# EasyEDA Pro project ProProject_SmartNixieClock_2023-12-15.epro, board Main
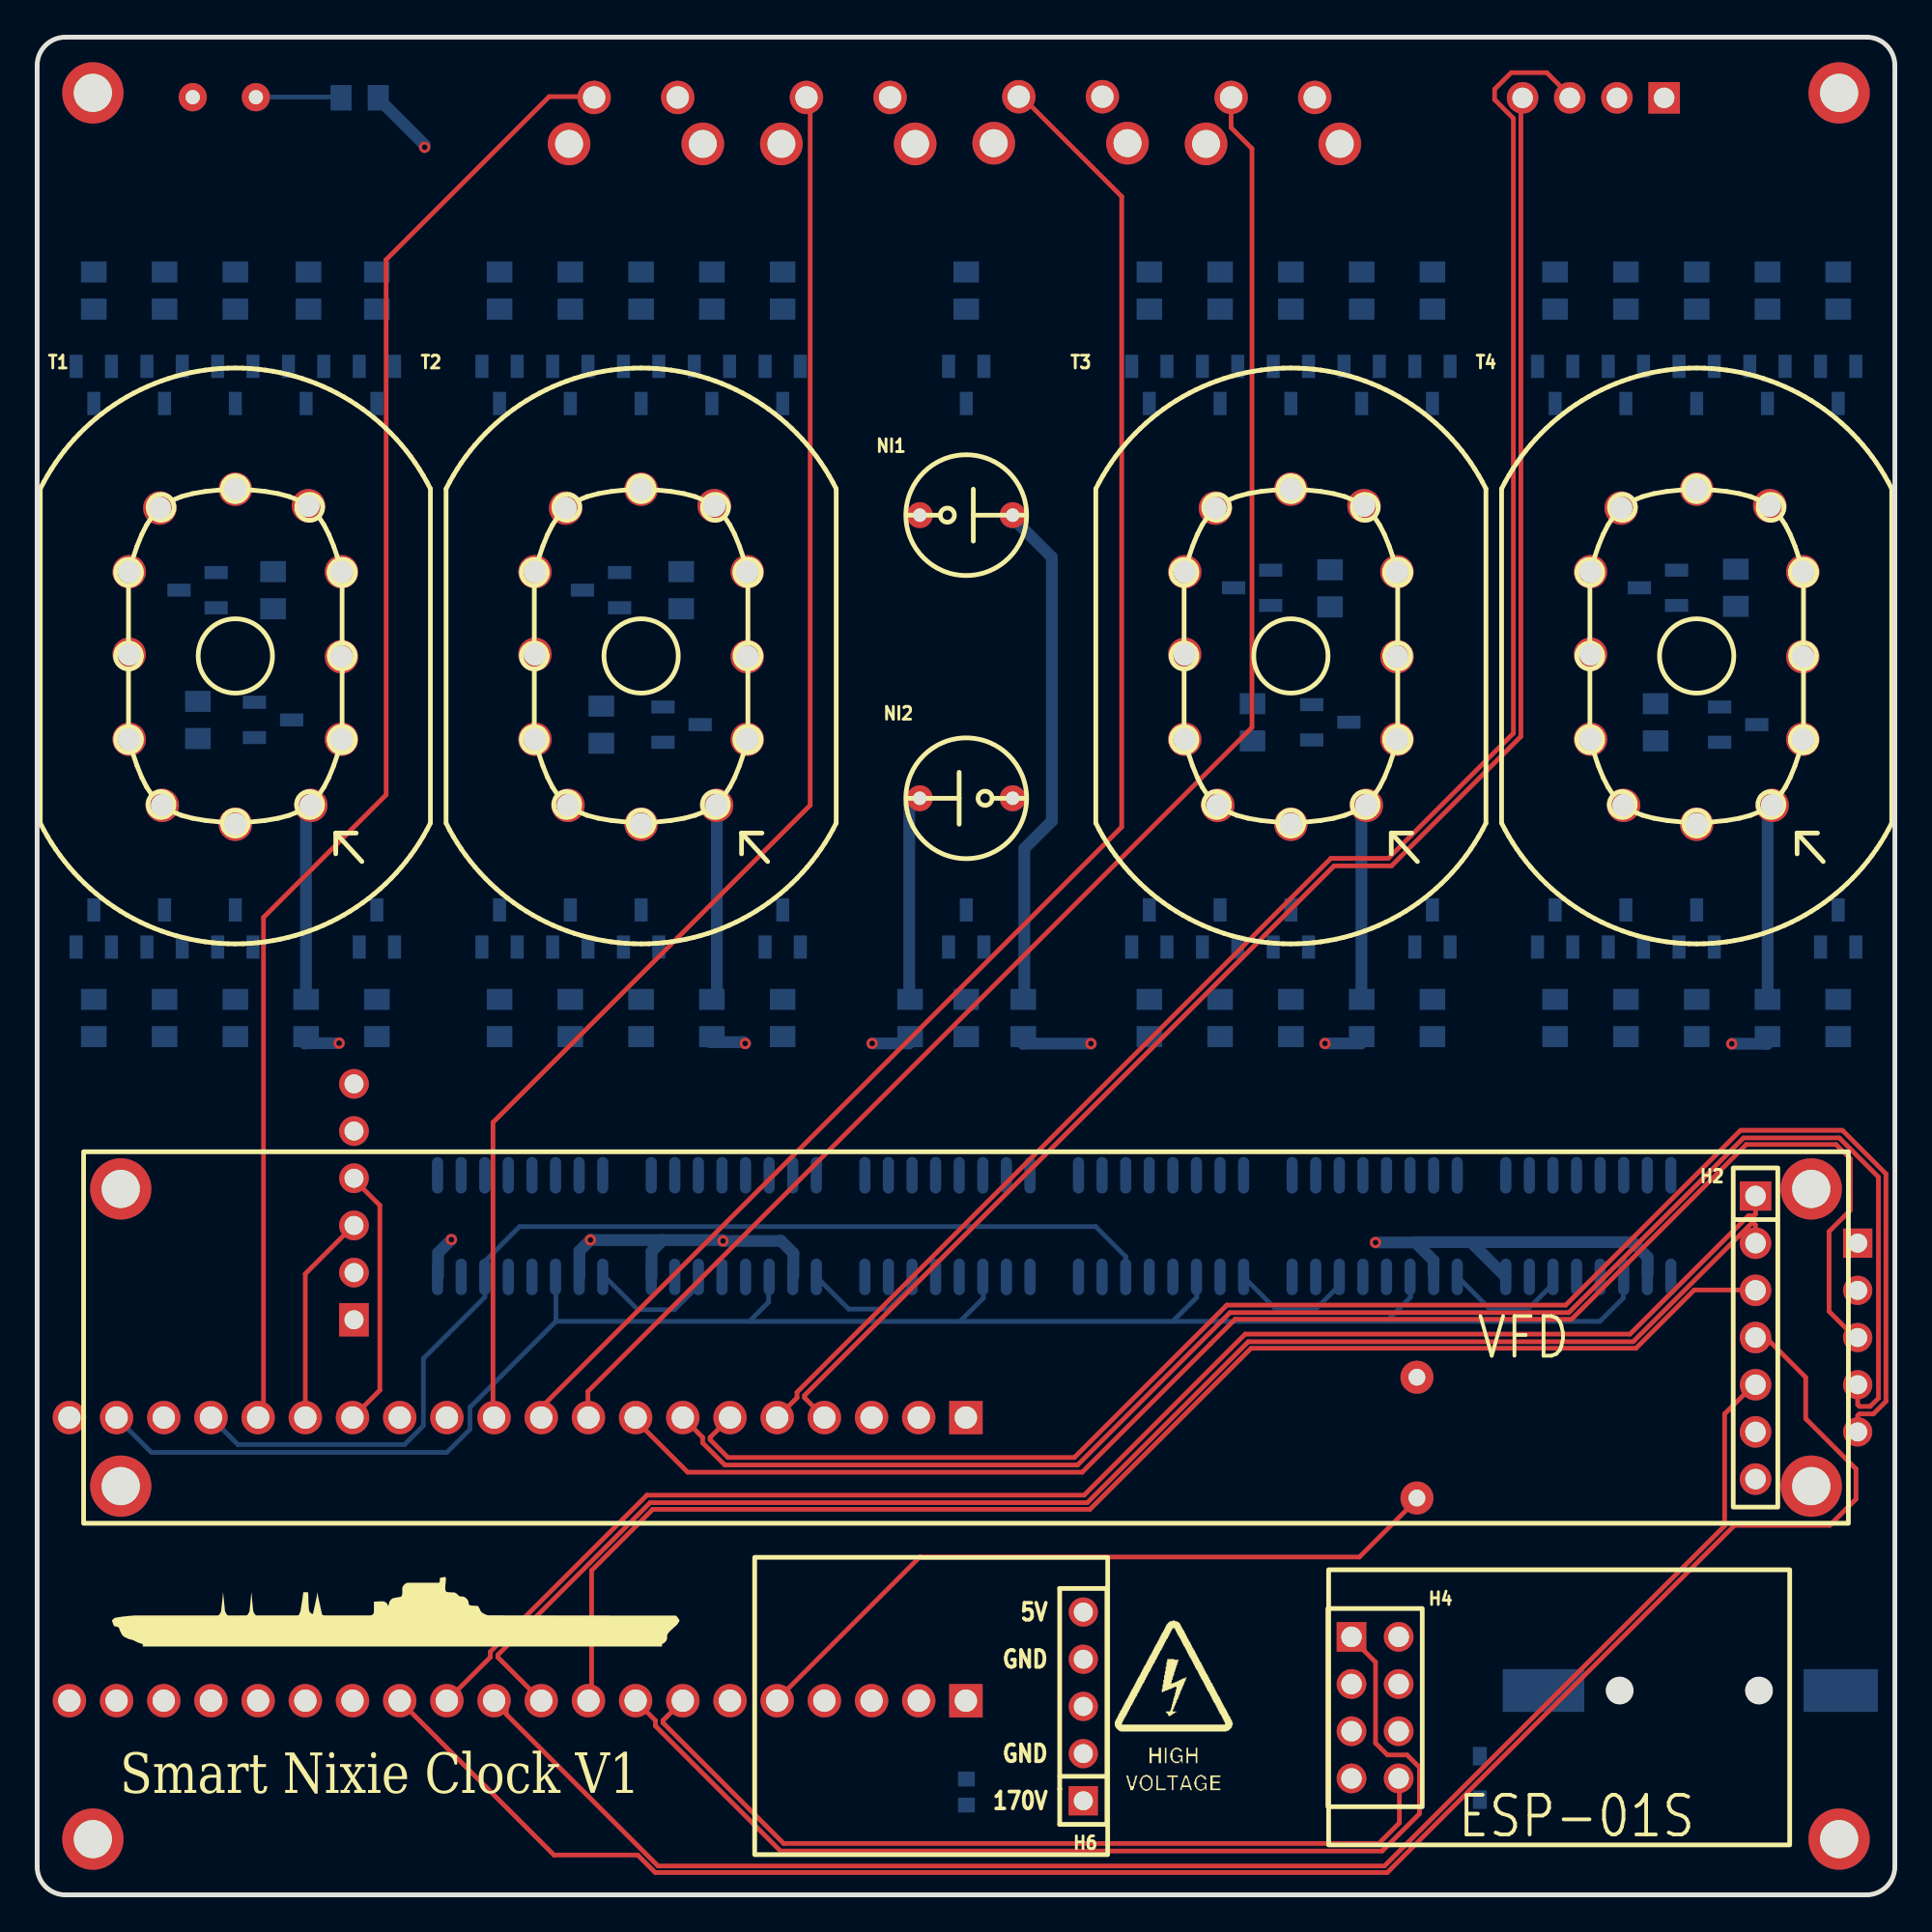
[diagram p4: board, top side]
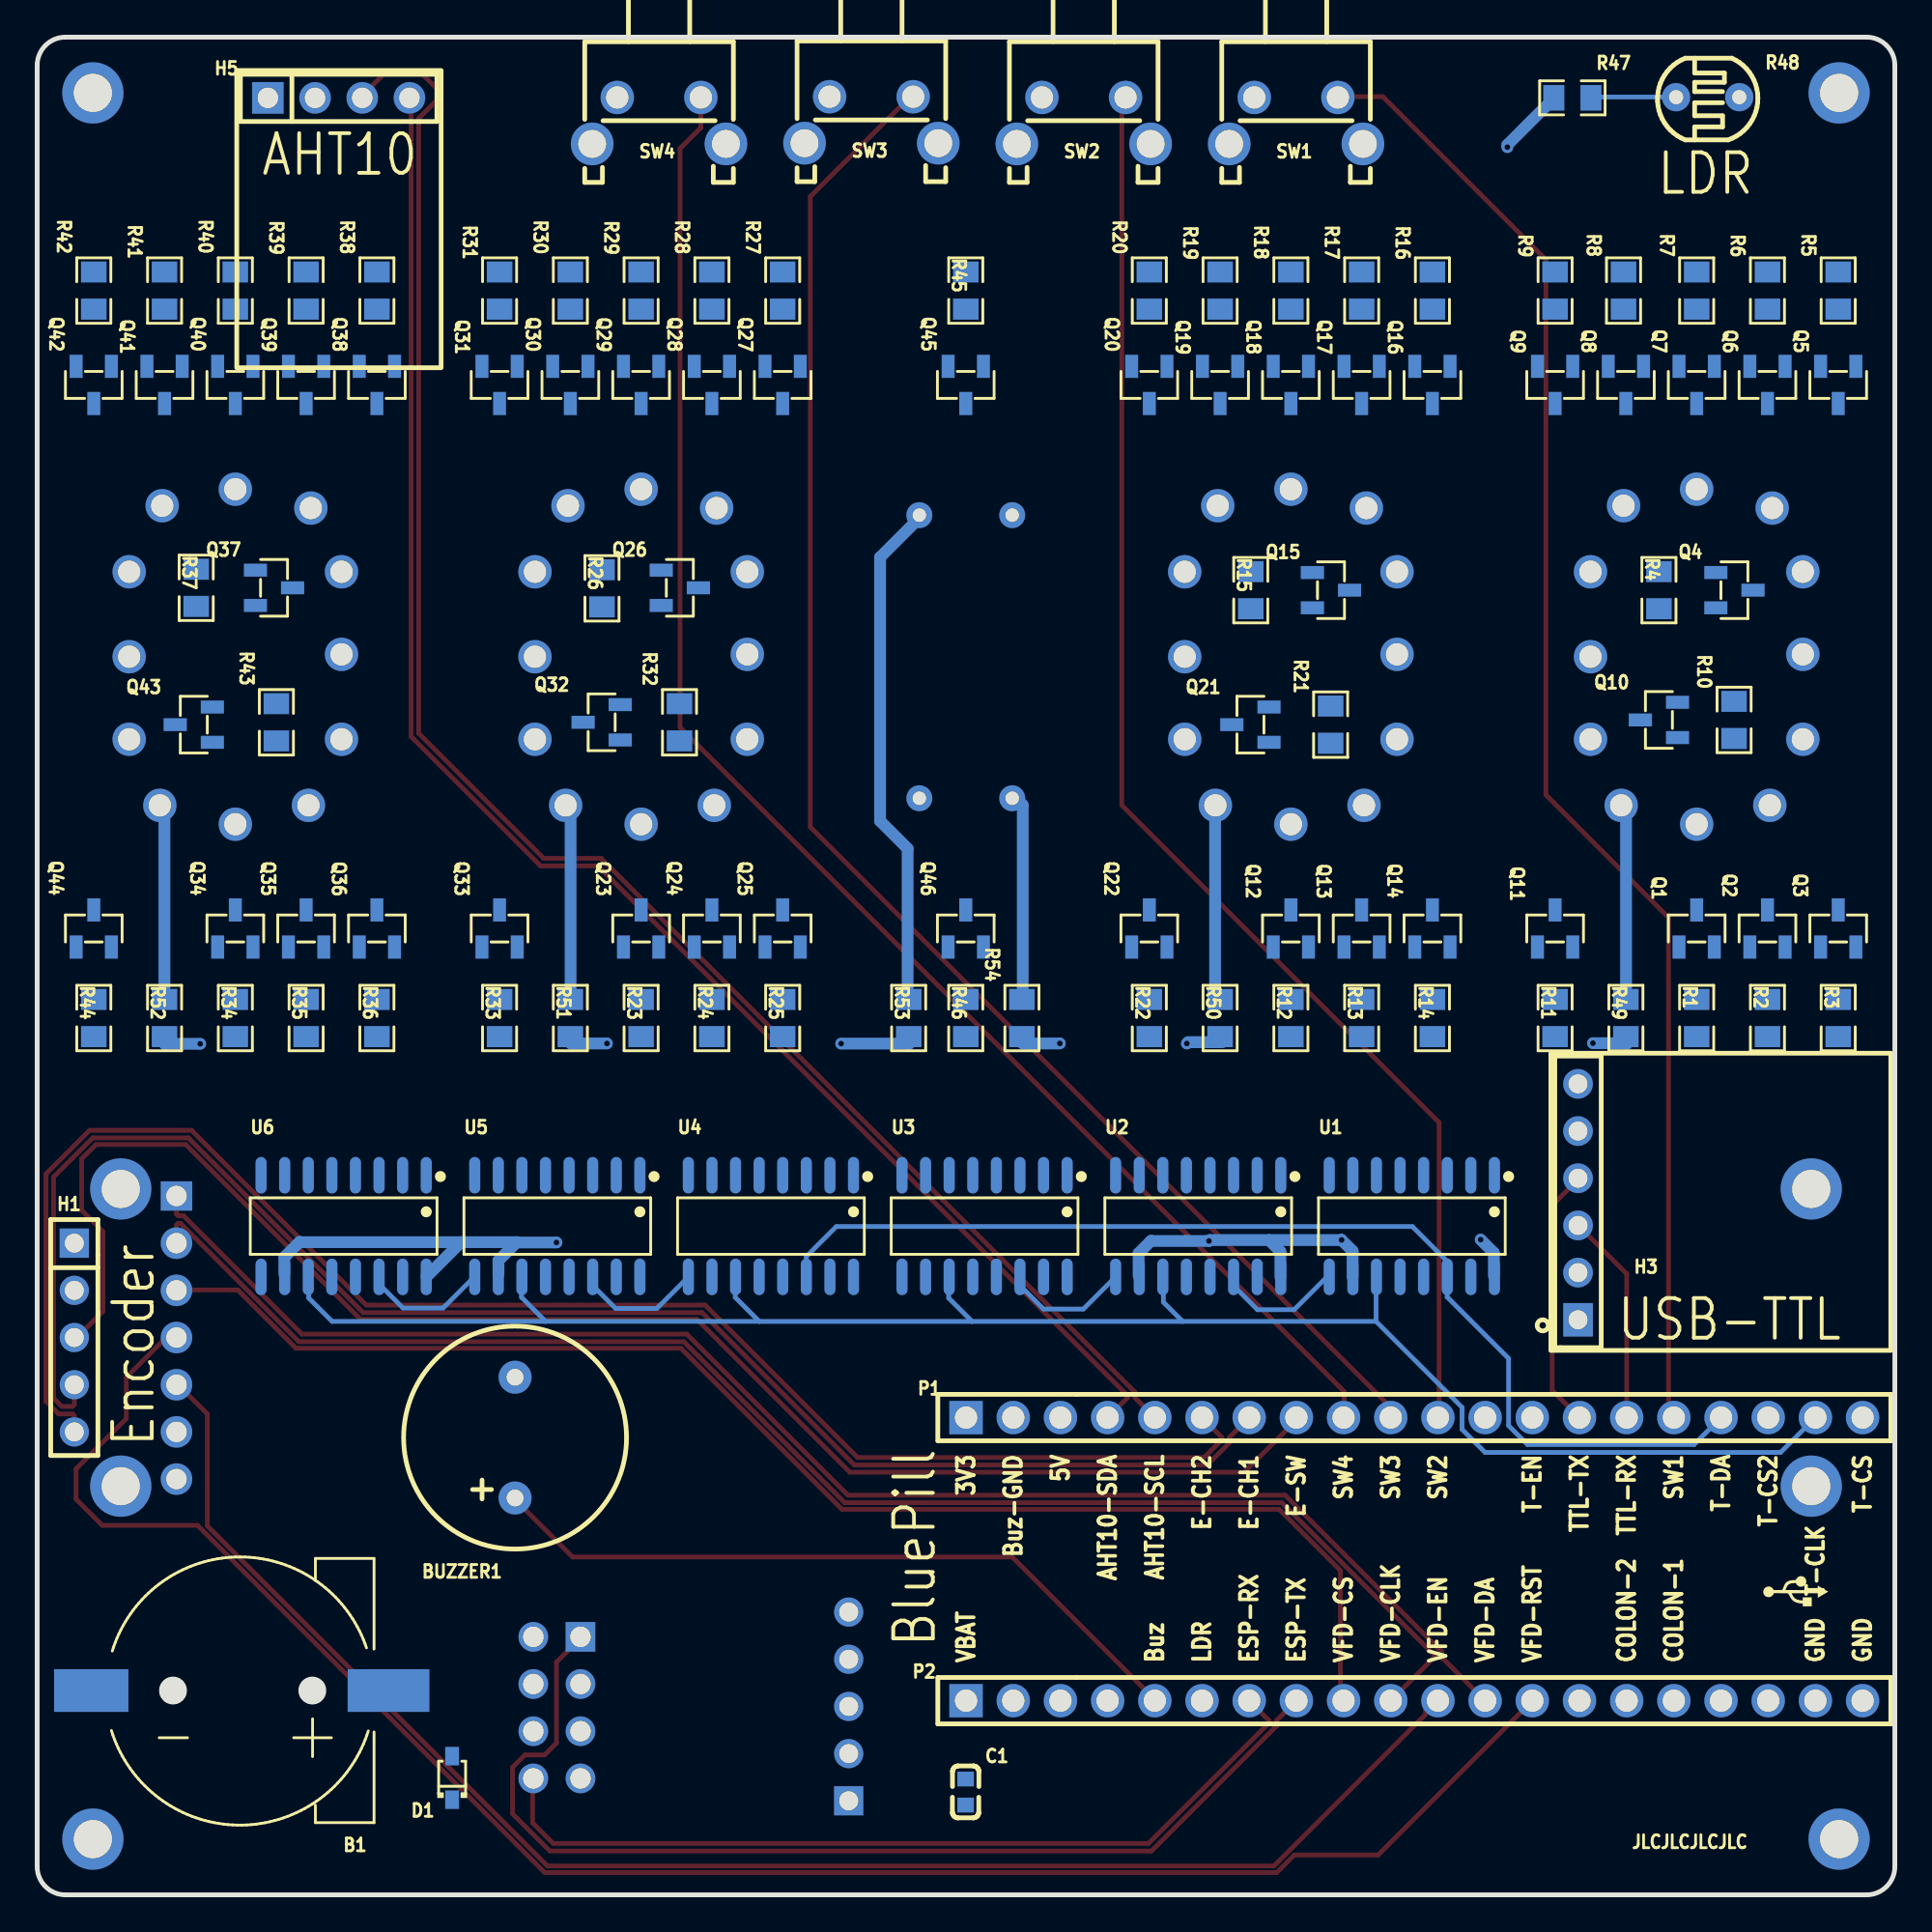
[diagram p5: board, bottom side, seen from below]

Outline 100 x 100 mm; copper layers: Top Layer, Inner1, Inner2, Bottom Layer. Coordinates in mm from the lower left corner of the outline.
Outline path: 0,98.48 0,1.52 arc(0.45,0.45) 1.52,0 98.48,0 arc(99.55,0.45) 100,1.52 100,98.48 arc(99.55,99.55) 98.48,100 1.52,100 arc(0.45,99.55) 0,98.48
Stack: Top Layer 0.035mm 外层铜厚1oz / Dielectric1 0.2104mm 7628 RC49% 8.6mil / Inner1 0.0152mm 内层铜厚 / Dielectric2 1.065mm 1.1mm H/HOZ 含铜 / Inner2 0.0152mm 内层铜厚 / Dielectric3 0.2104mm 7628 RC49% 8.6mil / Bottom Layer 0.035mm 外层铜厚1oz

## Design rules (mm)
net AHT10-SCL: DP1
net AHT10-SDA: DP1
net TTL-RX: DP3
net TTL-TX: DP3
net VFD-CLK: DP2
net ESP-TX: DP5
net ESP-RX: DP5
net VFD-DA: DP2
net T-DA: DP4
net T-CLK: DP4
net ENCODER-CH2: DP6
net ENCODER-CH1: DP6
template: 用户自定义配置
spacing copperThickness1oz (default): track to track 0.102, other pairs 0.152 to 0.3
spacing copperThickness2oz: track to track 0.203, other pairs 0.152 to 0.3
spacing copperThicknessInner0.5oz: track to track 0.089, other pairs 0.152 to 0.3
track width copperThickness1oz (default): min 0.102, default 0.254, max 2.54
track width copperThickness2oz: min 0.203, default 0.254, max 2.54
track width copperThickness0.5oz: min 0.089, default 0.254, max 2.54
track width +5V: min 0.635, default 0.635, max 2.54
track width +3V3: min 0.635, default 0.635, max 2.54
track width +170V: min 0.635, default 0.635, max 2.54
differential pair differentialPair (default): width min 0.127, default 0.254, max 2.54; gap min 0.152, default 0.152
via viaSize (default): diameter min 0.3, default 0.61, max 10; hole min 0.201, default 0.305, max 6.299
net +5V uses +5V
net $1N105872 uses +170V
net $1N105896 uses +170V
net $1N105920 uses +170V
net $1N105944 uses +170V
net $1N105947 uses +170V
net $1N105948 uses +170V
net +3V3 uses +3V3
net +170V uses +170V

## Placement (name value [footprint] x y rotation side)
B1  CR1220-2  [BAT-SMD_CR1220-2]  89.09 11 0 bottom
BUZZER1  2048Hz  [BUZ-TH_BD12.0-P6.50-D0.6-FD]  74.27 24.61 90 bottom
C1  100nF  [C0603]  50.02 5.53 270 bottom
D1  1N4148WS  [SOD-323_L1.8-W1.3-LS2.5-RD]  77.66 6.29 90 bottom
H1  PM254V-11-05-H85  [HDR-TH_5P-P2.54-V-F]  98 30 270 bottom
H2  PM254V-11-07-H85  [HDR-TH_7P-P2.54-V-F]  92.5 30 270 top
H3  PM254V-11-06-H85  [HDR-TH_6P-P2.54-V-F]  17.06 37.31 90 bottom
H4  PM254V-12-08-H85  [HDR-TH_8P-P2.54-V-F-R2-C4-S2.54]  72.02 10.08 270 top
H5  PM254V-11-04-H85  [HDR-TH_4P-P2.54-V-F]  83.77 96.73 180 bottom
H6  PM254V-11-05-H85  [HDR-TH_5P-P2.54-V-F]  56.31 10.14 90 top
NI1  -  [INS-1]  50.01 74.27 0 top
NI2  -  [INS-1]  50.01 59.03 180 top
NOREF  -  [Pad_e57]  3 97 0 top
NOREF#2  -  [Pad_e55]  97 97 0 top
NOREF#3  -  [Pad_e45]  4.5 22 0 top
NOREF#4  -  [Pad_e40]  4.5 38 0 top
NOREF#5  -  [Pad_e51]  95.5 38 0 top
NOREF#6  -  [Pad_e46]  95.5 22 0 top
NOREF#7  -  [Pad_e58]  3 3 0 top
NOREF#8  -  [Pad_e54]  97 3 0 top
P1  2.54-1*20P母  [HDR-TH_20P-P2.54-V-F]  25.87 25.69 180 bottom
P2  2.54-1*20P母  [HDR-TH_20P-P2.54-V-F]  25.87 10.45 180 bottom
Q1  13001  [SOT-23-3_L2.9-W1.3-P1.90-LS2.4-BR]  10.67 52.02 270 bottom
Q2  13001  [SOT-23-3_L2.9-W1.3-P1.90-LS2.4-BR]  6.86 52.02 270 bottom
Q3  13001  [SOT-23-3_L2.9-W1.3-P1.90-LS2.4-BR]  3.05 52.02 270 bottom
Q4  13001  [SOT-23-3_L2.9-W1.3-P1.90-LS2.4-BR]  8.64 70.23 0 bottom
Q5  13001  [SOT-23-3_L2.9-W1.3-P1.90-LS2.4-BR]  3.05 81.28 90 bottom
Q6  13001  [SOT-23-3_L2.9-W1.3-P1.90-LS2.4-BR]  6.86 81.28 90 bottom
Q7  13001  [SOT-23-3_L2.9-W1.3-P1.90-LS2.4-BR]  10.67 81.28 90 bottom
Q8  13001  [SOT-23-3_L2.9-W1.3-P1.90-LS2.4-BR]  14.48 81.28 90 bottom
Q9  13001  [SOT-23-3_L2.9-W1.3-P1.90-LS2.4-BR]  18.29 81.28 90 bottom
Q10  13001  [SOT-23-3_L2.9-W1.3-P1.90-LS2.4-BR]  12.7 63.25 180 bottom
Q11  13001  [SOT-23-3_L2.9-W1.3-P1.90-LS2.4-BR]  18.29 52.02 270 bottom
Q12  13001  [SOT-23-3_L2.9-W1.3-P1.90-LS2.4-BR]  32.51 52.02 270 bottom
Q13  13001  [SOT-23-3_L2.9-W1.3-P1.90-LS2.4-BR]  28.7 52.02 270 bottom
Q14  13001  [SOT-23-3_L2.9-W1.3-P1.90-LS2.4-BR]  24.89 52.02 270 bottom
Q15  13001  [SOT-23-3_L2.9-W1.3-P1.90-LS2.4-BR]  30.35 70.23 0 bottom
Q16  13001  [SOT-23-3_L2.9-W1.3-P1.90-LS2.4-BR]  24.89 81.28 90 bottom
Q17  13001  [SOT-23-3_L2.9-W1.3-P1.90-LS2.4-BR]  28.7 81.28 90 bottom
Q18  13001  [SOT-23-3_L2.9-W1.3-P1.90-LS2.4-BR]  32.51 81.28 90 bottom
Q19  13001  [SOT-23-3_L2.9-W1.3-P1.90-LS2.4-BR]  36.32 81.28 90 bottom
Q20  13001  [SOT-23-3_L2.9-W1.3-P1.90-LS2.4-BR]  40.13 81.28 90 bottom
Q21  13001  [SOT-23-3_L2.9-W1.3-P1.90-LS2.4-BR]  34.69 62.99 180 bottom
Q22  13001  [SOT-23-3_L2.9-W1.3-P1.90-LS2.4-BR]  40.13 52.02 270 bottom
Q23  13001  [SOT-23-3_L2.9-W1.3-P1.90-LS2.4-BR]  67.49 52.02 270 bottom
Q24  13001  [SOT-23-3_L2.9-W1.3-P1.90-LS2.4-BR]  63.68 52.02 270 bottom
Q25  13001  [SOT-23-3_L2.9-W1.3-P1.90-LS2.4-BR]  59.87 52.02 270 bottom
Q26  13001  [SOT-23-3_L2.9-W1.3-P1.90-LS2.4-BR]  65.41 70.36 0 bottom
Q27  13001  [SOT-23-3_L2.9-W1.3-P1.90-LS2.4-BR]  59.87 81.28 90 bottom
Q28  13001  [SOT-23-3_L2.9-W1.3-P1.90-LS2.4-BR]  63.68 81.28 90 bottom
Q29  13001  [SOT-23-3_L2.9-W1.3-P1.90-LS2.4-BR]  67.49 81.28 90 bottom
Q30  13001  [SOT-23-3_L2.9-W1.3-P1.90-LS2.4-BR]  71.3 81.28 90 bottom
Q31  13001  [SOT-23-3_L2.9-W1.3-P1.90-LS2.4-BR]  75.11 81.28 90 bottom
Q32  13001  [SOT-23-3_L2.9-W1.3-P1.90-LS2.4-BR]  69.61 63.12 180 bottom
Q33  13001  [SOT-23-3_L2.9-W1.3-P1.90-LS2.4-BR]  75.11 52.02 270 bottom
Q34  13001  [SOT-23-3_L2.9-W1.3-P1.90-LS2.4-BR]  89.33 52.02 270 bottom
Q35  13001  [SOT-23-3_L2.9-W1.3-P1.90-LS2.4-BR]  85.52 52.02 270 bottom
Q36  13001  [SOT-23-3_L2.9-W1.3-P1.90-LS2.4-BR]  81.71 52.02 270 bottom
Q37  13001  [SOT-23-3_L2.9-W1.3-P1.90-LS2.4-BR]  87.25 70.36 0 bottom
Q38  13001  [SOT-23-3_L2.9-W1.3-P1.90-LS2.4-BR]  81.71 81.28 90 bottom
Q39  13001  [SOT-23-3_L2.9-W1.3-P1.90-LS2.4-BR]  85.52 81.28 90 bottom
Q40  13001  [SOT-23-3_L2.9-W1.3-P1.90-LS2.4-BR]  89.33 81.28 90 bottom
Q41  13001  [SOT-23-3_L2.9-W1.3-P1.90-LS2.4-BR]  93.14 81.28 90 bottom
Q42  13001  [SOT-23-3_L2.9-W1.3-P1.90-LS2.4-BR]  96.95 81.28 90 bottom
Q43  13001  [SOT-23-3_L2.9-W1.3-P1.90-LS2.4-BR]  91.57 62.99 180 bottom
Q44  13001  [SOT-23-3_L2.9-W1.3-P1.90-LS2.4-BR]  96.95 52.02 270 bottom
Q45  13001  [SOT-23-3_L2.9-W1.3-P1.90-LS2.4-BR]  50.01 81.28 90 bottom
Q46  13001  [SOT-23-3_L2.9-W1.3-P1.90-LS2.4-BR]  50.01 52.02 270 bottom
R1  1kΩ  [R0805]  10.67 47.2 90 bottom
R2  1kΩ  [R0805]  6.86 47.2 90 bottom
R3  1kΩ  [R0805]  3.05 47.2 90 bottom
R4  1kΩ  [R0805]  12.7 70.23 90 bottom
R5  1kΩ  [R0805]  3.05 86.36 270 bottom
R6  1kΩ  [R0805]  6.86 86.36 270 bottom
R7  1kΩ  [R0805]  10.67 86.36 270 bottom
R8  1kΩ  [R0805]  14.61 86.36 270 bottom
R9  1kΩ  [R0805]  18.29 86.36 270 bottom
R10  1kΩ  [R0805]  8.65 63.25 270 bottom
R11  1kΩ  [R0805]  18.29 47.2 90 bottom
R12  1kΩ  [R0805]  32.51 47.2 90 bottom
R13  1kΩ  [R0805]  28.7 47.2 90 bottom
R14  1kΩ  [R0805]  24.89 47.2 90 bottom
R15  1kΩ  [R0805]  34.67 70.23 90 bottom
R16  1kΩ  [R0805]  24.89 86.36 270 bottom
R17  1kΩ  [R0805]  28.7 86.36 270 bottom
R18  1kΩ  [R0805]  32.51 86.36 270 bottom
R19  1kΩ  [R0805]  36.32 86.36 270 bottom
R20  1kΩ  [R0805]  40.13 86.36 270 bottom
R21  1kΩ  [R0805]  30.37 62.99 270 bottom
R22  1kΩ  [R0805]  40.13 47.2 90 bottom
R23  1kΩ  [R0805]  67.49 47.2 90 bottom
R24  1kΩ  [R0805]  63.68 47.2 90 bottom
R25  1kΩ  [R0805]  59.87 47.2 90 bottom
R26  1kΩ  [R0805]  69.6 70.33 90 bottom
R27  1kΩ  [R0805]  59.87 86.36 270 bottom
R28  1kΩ  [R0805]  63.68 86.36 270 bottom
R29  1kΩ  [R0805]  67.49 86.36 270 bottom
R30  1kΩ  [R0805]  71.3 86.36 270 bottom
R31  1kΩ  [R0805]  75.11 86.36 270 bottom
R32  1kΩ  [R0805]  65.42 63.12 270 bottom
R33  1kΩ  [R0805]  75.11 47.2 90 bottom
R34  1kΩ  [R0805]  89.33 47.2 90 bottom
R35  1kΩ  [R0805]  85.52 47.2 90 bottom
R36  1kΩ  [R0805]  81.71 47.2 90 bottom
R37  1kΩ  [R0805]  91.44 70.36 90 bottom
R38  1kΩ  [R0805]  81.71 86.36 270 bottom
R39  1kΩ  [R0805]  85.52 86.36 270 bottom
R40  1kΩ  [R0805]  89.33 86.36 270 bottom
R41  1kΩ  [R0805]  93.14 86.36 270 bottom
R42  1kΩ  [R0805]  96.95 86.36 270 bottom
R43  1kΩ  [R0805]  87.12 63.12 270 bottom
R44  1kΩ  [R0805]  96.95 47.2 90 bottom
R45  1kΩ  [R0805]  50.01 86.36 90 bottom
R46  1kΩ  [R0805]  50.01 47.2 90 bottom
R47  10kΩ  [R0805]  17.36 96.73 0 bottom
R48  GL5516  [RES-TH_L5.1-W4.3-P3.40-D0.5]  10.08 96.77 90 bottom
R49  20kΩ  [R0805]  14.48 47.2 90 bottom
R50  20kΩ  [R0805]  36.32 47.2 90 bottom
R51  20kΩ  [R0805]  71.3 47.2 90 bottom
R52  20kΩ  [R0805]  93.14 47.2 90 bottom
R53  200kΩ  [R0805]  53.09 47.2 90 bottom
R54  200kΩ  [R0805]  46.99 47.2 270 bottom
SW1  TS-1093C-A13B2-D1  [SW-TH_TS-1093C-A13B3-D1]  32.23 95.5 0 bottom
SW2  TS-1093C-A13B2-D1  [SW-TH_TS-1093C-A13B3-D1]  43.66 95.5 0 bottom
SW3  TS-1093C-A13B2-D1  [SW-TH_TS-1093C-A13B3-D1]  55.09 95.54 0 bottom
SW4  TS-1093C-A13B2-D1  [SW-TH_TS-1093C-A13B3-D1]  66.52 95.5 0 bottom
T1  IN-12b辉光管  [IN-12b(正常,插針在上面)]  10.67 66.65 0 top
T2  IN-12b辉光管  [IN-12b(正常,插針在上面)]  32.51 66.65 0 top
T3  IN-12b辉光管  [IN-12b(正常,插針在上面)]  67.49 66.65 0 top
T4  IN-12b辉光管  [IN-12b(正常,插針在上面)]  89.33 66.65 0 top
U1  74HC595D,118  [SOIC-16_L9.9-W3.9-P1.27-LS6.0-BL]  26 36 0 bottom
U2  74HC595D,118  [SOIC-16_L9.9-W3.9-P1.27-LS6.0-BL]  37.5 36 0 bottom
U3  74HC595D,118  [SOIC-16_L9.9-W3.9-P1.27-LS6.0-BL]  49 36 0 bottom
U4  74HC595D,118  [SOIC-16_L9.9-W3.9-P1.27-LS6.0-BL]  60.5 36 0 bottom
U5  74HC595D,118  [SOIC-16_L9.9-W3.9-P1.27-LS6.0-BL]  72 36 0 bottom
U6  74HC595D,118  [SOIC-16_L9.9-W3.9-P1.27-LS6.0-BL]  83.5 36 0 bottom

## Footprints (pads in the part's own frame, mm; a bottom-side part is the same pattern mirrored in y, then rotated)
BAT-SMD_CR1220-2
  rect 4.4x2.3 smd: 1(-8,0)
  rect 4x2.3 smd: 2(8,0)
BUZ-TH_BD12.0-P6.50-D0.6-FD
  round 1.778 hole 0.9: 1(-3.251,0) 2(3.251,0)
C0603
  rect 0.8x0.9 smd: 1(-0.7,0) 2(0.7,0)
HDR-TH_4P-P2.54-V-F
  rect 1.7x1.7 hole 1.1: 1(-3.81,0)
  round 1.7 hole 1.1: 2(-1.27,0) 3(1.27,0) 4(3.81,0)
HDR-TH_5P-P2.54-V-F
  rect 1.575x1.575 hole 1.02: 1(-5.08,0)
  round 1.575 hole 1.02: 2(-2.54,0) 3(0,0) 4(2.54,0) 5(5.08,0)
HDR-TH_6P-P2.54-V-F
  rect 1.8x1.6 hole 1.02: 1(-6.35,0)
  round 1.6 hole 1.02: 2(-3.81,0) 3(-1.27,0) 4(1.27,0) 5(3.81,0) 6(6.35,0)
HDR-TH_7P-P2.54-V-F
  rect 1.575x1.7 hole 1.1: 1(-7.62,0)
  round 1.7 hole 1.1: 2(-5.08,0) 3(-2.54,0) 4(0,0) 5(2.54,0) 6(5.08,0) 7(7.62,0)
HDR-TH_8P-P2.54-V-F-R2-C4-S2.54
  rect 1.6x1.6 hole 1.1: 1(-3.81,-1.27)
  round 1.6 hole 1.1: 2(-3.81,1.27) 3(-1.27,-1.27) 4(-1.27,1.27) 5(1.27,-1.27) 6(1.27,1.27) 7(3.81,-1.27) 8(3.81,1.27)
HDR-TH_20P-P2.54-V-F
  rect 1.8x1.8 hole 1.2: 1(-24.13,0)
  round 1.8 hole 1.2: 2(-21.59,0) 3(-19.05,0) 4(-16.51,0) 5(-13.97,0) 6(-11.43,0) 7(-8.89,0) 8(-6.35,0) 9(-3.81,0) 10(-1.27,0) 11(1.27,0) 12(3.81,0) 13(6.35,0) 14(8.89,0) 15(11.43,0) 16(13.97,0) 17(16.51,0) 18(19.05,0) 19(21.59,0) 20(24.13,0)
IN-12b(正常,插針在上面)
  round 1.8 hole 1.2x1.05: 1(4.064,-8.001) 2(5.715,-4.445) 3(5.715,0) 4(5.715,4.572) 5(3.937,8.128) 6(0,9.017) 7(-4.064,8.001) 8(-5.715,4.572) 9(-5.715,0.127) 10(-5.715,-4.445) 11(-3.937,-8.001) 12(0,-9.017)
INS-1
  round 1.4 hole 0.72: 1(2.5,0) 2(-2.5,0)
Pad_e40
  round 3.3 hole 2.05: M2(0,0)
Pad_e45
  round 3.3 hole 2.05: M2(0,0)
Pad_e46
  round 3.3 hole 2.05: M2(0,0)
Pad_e51
  round 3.3 hole 2.05: M2(0,0)
Pad_e54
  round 3.3 hole 2.05: M2(0,0)
Pad_e55
  round 3.3 hole 2.05: M2(0,0)
Pad_e57
  round 3.3 hole 2.05: M2(0,0)
Pad_e58
  round 3.3 hole 2.05: M2(0,0)
R0805
  rect 1.133x1.377 smd: 1(-1,0) 2(1,0)
RES-TH_L5.1-W4.3-P3.40-D0.5
  round 1.524 hole 0.762: 1(0,1.7) 2(0,-1.7)
SOD-323_L1.8-W1.3-LS2.5-RD
  rect 1x0.75 smd: 1(-1.173,0) 2(1.173,0)
SOIC-16_L9.9-W3.9-P1.27-LS6.0-BL
  oval 0.602x1.971 smd: 1(-4.445,-2.736) 2(-3.175,-2.736) 3(-1.905,-2.736) 4(-0.635,-2.736) 5(0.635,-2.736) 6(1.905,-2.736) 7(3.175,-2.736) 8(4.445,-2.736) 9(4.445,2.736) 10(3.175,2.736) 11(1.905,2.736) 12(0.635,2.736) 13(-0.635,2.736) 14(-1.905,2.736) 15(-3.175,2.736) 16(-4.445,2.736)
SOT-23-3_L2.9-W1.3-P1.90-LS2.4-BR
  rect 1.25x0.7 smd: 1(1,-0.95) 2(1,0.95) 3(-1,0)
SW-TH_TS-1093C-A13B3-D1
  round 1.8 hole 1.2: 1(-2.25,-1.25) 2(2.25,-1.25)
  round 2.3 hole 1.5: 3(-3.6,1.25) 4(3.6,1.25)

## Nets
As in the schematic.

Pads without a net: H3 1 2; H4 3 4 5 6; H6 3; NOREF M2; NOREF#2 M2; NOREF#3 M2; NOREF#4 M2; NOREF#5 M2; NOREF#6 M2; NOREF#7 M2; NOREF#8 M2; P1 12; P2 2 3 4 14 17 18; SW1 3 4; SW2 3 4; SW3 3 4; SW4 3 4; U3 6 7 9; U6 6 7 9

## Via types
v1: diameter 0.61, hole 0.305, Top Layer to Bottom Layer, 11 vias

## Routing (per net, layer and track width the routed paths; a pad name or vN(x,y) marks a point on that pad's centre or on a via; arc(x,y) is an arc through that point)
+3V3: length 126.7
  Inner2 w0.635: 70.72,6.36 70.72,5.76 68.34,3.38 53.32,3.38 52.69,4.01 52.69,22.89 49.89,25.69 ; 50.15,25.81 23.11,52.85 23.11,91.87 20.94,94.04
  Bottom Layer w0.635: 18.38,96.68 20.86,94.2 v1(20.86,94.08)
+5V: length 284
  Inner1 w0.635: 92.67,24.85 95.41,27.58 95.41,30.74 97.21,32.54 98.02,32.54 ; 48.39,22.1 55.27,15.23 56.41,15.23 ; 48.39,22.1 65.1,22.1 67.49,24.49 83.66,24.49 ; 48.39,22.1 44.96,25.54 ; 72.05,35.11 54.21,35.11 45.13,26.03 ; 83.66,24.49 91.98,24.49 92.49,25 ; 83.66,24.49 89.75,30.57 89.75,39.69 94.86,44.8 94.86,56.91 96.97,59.02 96.97,87.34 87.6,96.71 ; 83.66,24.49 83.65,24.47 ; 45.13,26.03 45.04,25.94 ; 45.13,26.03 45.13,34.82 38.72,41.23 17.04,41.23 ; 87.64,96.8 87.25,96.41 ; 36.95,35.19 41.01,31.13 41.01,29.39 44.73,25.67 ; v1(29.78,35.25) 22.33,35.25
  Bottom Layer w0.635: 74.18,35.13 77.19,35.13 ; 74.18,35.13 74.16,35.12 v1(72.05,35.12) ; 74.18,35.13 75.17,34.14 75.17,33.41 ; 77.19,35.13 85.85,35.13 85.87,35.15 86.69,34.32 86.69,33.42 ; 77.19,35.13 79.04,33.28 ; 40.71,33.32 40.71,34.54 40.04,35.21 40.03,35.2 v1(36.92,35.2) 36.87,35.25 33.69,35.25 ; 33.08,33.25 33.08,34.63 33.69,35.25 ; v1(22.3,35.27) 21.58,34.56 21.58,33.33 ; 29.19,33.26 29.19,34.66 29.79,35.26 29.81,35.25 33.69,35.25
+170V: length 131.6
  Inner1 w0.635: 16.28,45.85 16.31,45.82 v1(56.72,45.82) 91.23,45.82 91.23,45.82
  Inner2 w0.635: 56.74,45.82 56.73,45.81 56.73,45.78 56.75,45.78 59.87,42.66 59.87,8.63 56.52,5.28
  Bottom Layer w0.635: 14.41,45.82 14.44,45.85 v1(16.25,45.85) ; v1(38.11,45.83) 38.04,45.9 36.19,45.9 ; v1(44.95,45.83) 46.94,45.83 46.98,45.88 ; v1(56.72,45.82) 53.09,45.82 53.07,45.8 ; v1(91.22,45.81) 93.12,45.81 93.13,45.8 ; 71.3,45.86 71.26,45.83 v1(69.33,45.83)
AHT10-SCL: length 95.2
  Top Layer w0.254: 82.49,96.71 82.49,96.86 81.26,98.09 79.35,98.09 78.46,97.2 78.46,96.64 79.46,95.63 79.46,62.53 72.73,55.79 69.64,55.79 40.9,27.05 40.9,26.76 P1.5
AHT10-SDA: length 89.2
  Top Layer w0.254: P1.4 41.31,26.76 41.31,26.89 69.81,55.39 72.9,55.39 79.87,62.36 79.87,96.64 79.85,96.66
BUZZER: length 38.8
  Top Layer w0.254: 74.33,21.34 71.18,18.19 47.51,18.19 39.94,10.61
BUZZER-GND: length 27.2
  Inner1 w0.254: 74.21,27.82 49.93,27.82 47.88,25.78
ENCODER-CH1: length 88.1
  Top Layer w0.254: H1.4 98,26.38 98.09,26.29 98.67,26.29 99.12,26.74 99.12,38.64 97.01,40.75 91.86,40.75 82.45,31.34 64.21,31.34 56.01,23.14 37.01,23.14 35.82,24.33 35.82,24.62 P1.7
ENCODER-CH2: length 88.5
  Top Layer w0.254: P1.6 36.23,24.62 36.23,24.5 37.18,23.55 55.84,23.55 64.04,31.75 82.28,31.75 91.69,41.15 97.18,41.15 99.52,38.81 99.52,26.57 98.84,25.89 98.09,25.89 98,25.8 H1.5
ENCODER-SW: length 85
  Top Layer w0.254: 32.17,25.6 35.02,22.75 56.26,22.75 63.16,29.66 63.16,29.66 64.48,30.98 82.6,30.98 92,40.39 96.83,40.39 97.6,39.62 97.6,36.85 96.46,35.71 96.46,31.41 97.84,30.03 97.97,30.03
ESP-RX: length 46.8
  Top Layer w0.254: P2.7 33.69,9.38 33.69,9.26 40.18,2.77 72.22,2.77 73.33,3.87 73.33,6.18 73.29,6.22
ESP-TX: length 58.1
  Top Layer w0.254: 70.78,13.82 70.78,13.8 72.05,12.53 72.05,8.17 72.69,7.53 73.74,7.53 74.41,6.86 74.41,4.37 72.4,2.36 40.01,2.36 33.28,9.09 33.28,9.38 P2.8
LDR: length 102.5
  Inner2 w0.254: 37.17,10.62 24.61,23.18 22.3,23.18 20.82,24.65 20.82,71.51 11.87,80.46 11.87,96.57 11.78,96.66
  Bottom Layer w0.254: 16.38,96.78 12.01,96.78 11.89,96.9
SW1: length 79.7
  Top Layer w0.254: 29.96,96.8 27.56,96.8 18.78,88.01 18.79,88 18.79,59.22 12.18,52.61 12.18,25.91
SW2: length 78.5
  Top Layer w0.254: 41.61,96.82 41.61,58.66 24.54,41.58 24.54,25.38
SW3: length 86.2
  Top Layer w0.254: 27.18,25.72 27.18,26.28 58.38,57.48 58.38,91.42 53.02,96.78
SW4: length 86.4
  Top Layer w0.254: 29.65,25.5 29.65,27.1 65.39,62.84 65.39,94 64.27,95.13 64.27,96.62
T-CLK: length 101.3
  Bottom Layer w0.254: 49.68,30.87 50.93,32.12 50.93,33.23 ; 49.68,30.87 61.13,30.87 ; 49.68,30.87 38.34,30.87 ; 39.38,33.25 39.38,31.91 38.34,30.87 ; 27.93,30.87 38.34,30.87 ; 27.93,30.87 23.3,26.24 23.3,25.06 22.06,23.82 6.15,23.82 P1.19 ; 27.93,30.87 27.93,33.33 27.85,33.41 ; 73.93,33.28 73.93,32.17 72.63,30.87 ; 61.13,30.87 62.42,32.16 62.42,33.26 ; 61.13,30.87 72.63,30.87 ; 72.63,30.87 84.12,30.87 85.38,32.13 85.38,33.26
T-DA: length 59.7
  Bottom Layer w0.254: P1.17 10.81,24.24 19.77,24.24 20.79,25.26 20.79,28.88 24.1,32.18 24.1,34.1 25.97,35.97 56.98,35.97 58.6,34.36 58.6,33.25
TTL-RX: length 11.3
  Top Layer w0.254: 16.98,35.98 14.44,33.44 P1.15
TTL-TX: length 14.1
  Top Layer w0.254: 17.04,38.57 17.04,38.52 18.45,37.12 18.45,27.16 P1.14
VFD-CLK: length 81.8
  Top Layer w0.254: H2.2 92.5,36.06 92.41,36.15 92.28,36.15 85.91,29.78 65.2,29.78 56.53,21.11 32.99,21.11 24.8,12.92 24.8,12.79 P2.10
VFD-CS: length 76.2
  Top Layer w0.254: 92.56,32.55 92.55,32.56 89.2,32.56 86.06,29.42 65.34,29.42 56.67,20.75 33.14,20.75 29.85,17.46 29.85,10.22
VFD-DA: length 82.4
  Top Layer w0.254: P2.12 24.39,12.79 24.39,13.08 32.82,21.52 56.36,21.52 65.03,30.18 85.75,30.18 92.12,36.55 92.41,36.55 92.5,36.64 H2.1
VFD-EN: length 86
  Top Layer w0.254: 25.26,10.74 25.26,9.71 33.42,1.56 72.53,1.56 90.84,19.86 90.84,25.89 92.42,27.47 92.58,27.47
VFD-RST: length 101.5
  Top Layer w0.254: 92.44,29.96 93.1,29.96 95.2,27.85 95.2,25.63 97.91,22.93 97.91,21.3 96.5,19.89 91.37,19.89 72.68,1.2 33.27,1.2 32.33,2.14 27.82,2.14 19.74,10.23
$1N458: length 7
  Bottom Layer w0.254: 30.4,33.44 32.34,31.5 34.31,31.5 35.58,32.77 35.58,33.28
$1N9030: length 6.9
  Bottom Layer w0.254: 41.93,33.28 43.68,31.53 45.83,31.53 47.13,32.84 47.13,33.31
$1N54382: length 6.8
  Bottom Layer w0.254: 81.57,33.28 81.57,32.86 80.3,31.59 78.15,31.59 76.46,33.28
$1N105872: length 10.4
  Bottom Layer w0.635: 14.47,48.23 14.47,58.58 14.43,58.62
$1N105896: length 9.9
  Bottom Layer w0.635: 36.59,48.71 36.59,58.56 36.58,58.57
$1N105920: length 10.3
  Bottom Layer w0.635: 71.28,48.26 71.28,58.52 71.29,58.53
$1N105944: length 10.3
  Bottom Layer w0.635: 93.15,48.37 93.15,58.59 93.21,58.65
$1N105947: length 10.8
  Bottom Layer w0.635: 46.94,48.33 46.94,58.67 47.31,59.03
$1N105948: length 27.4
  Bottom Layer w0.635: 53.14,48.38 53.14,56.32 54.62,57.8 54.62,72 52.42,74.2
$1N177857: length 6.8
  Bottom Layer w0.254: 70.1,33.24 70.1,32.81 68.85,31.56 66.65,31.56 64.95,33.26

## Text on the board
Bottom Silkscreen Layer: JLCJLCJLCJLC | GND | COLON-1 | COLON-2 | VFD-RST | VFD-DA | VFD-EN | VFD-CLK | ESP-TX | ESP-RX | LDR | Buz | VBAT | T-CS | T-CLK | T-CS2 | T-DA | SW1 | TTL-RX | TTL-TX | T-EN | SW2 | SW3 | SW4 | E-SW | E-CH1 | E-CH2 | AHT10-SCL | AHT10-SDA | 5V | Buz-GND | 3V3 | VFD-CS | AHT10 | Encoder | BluePill | USB-TTL
Top Silkscreen Layer: 5V | GND | 170V | ESP-01S | VFD | Smart Nixie Clock V1
